# EAGLE design EcobitNRF9160 EV3 (EAGLE 9.3.0)
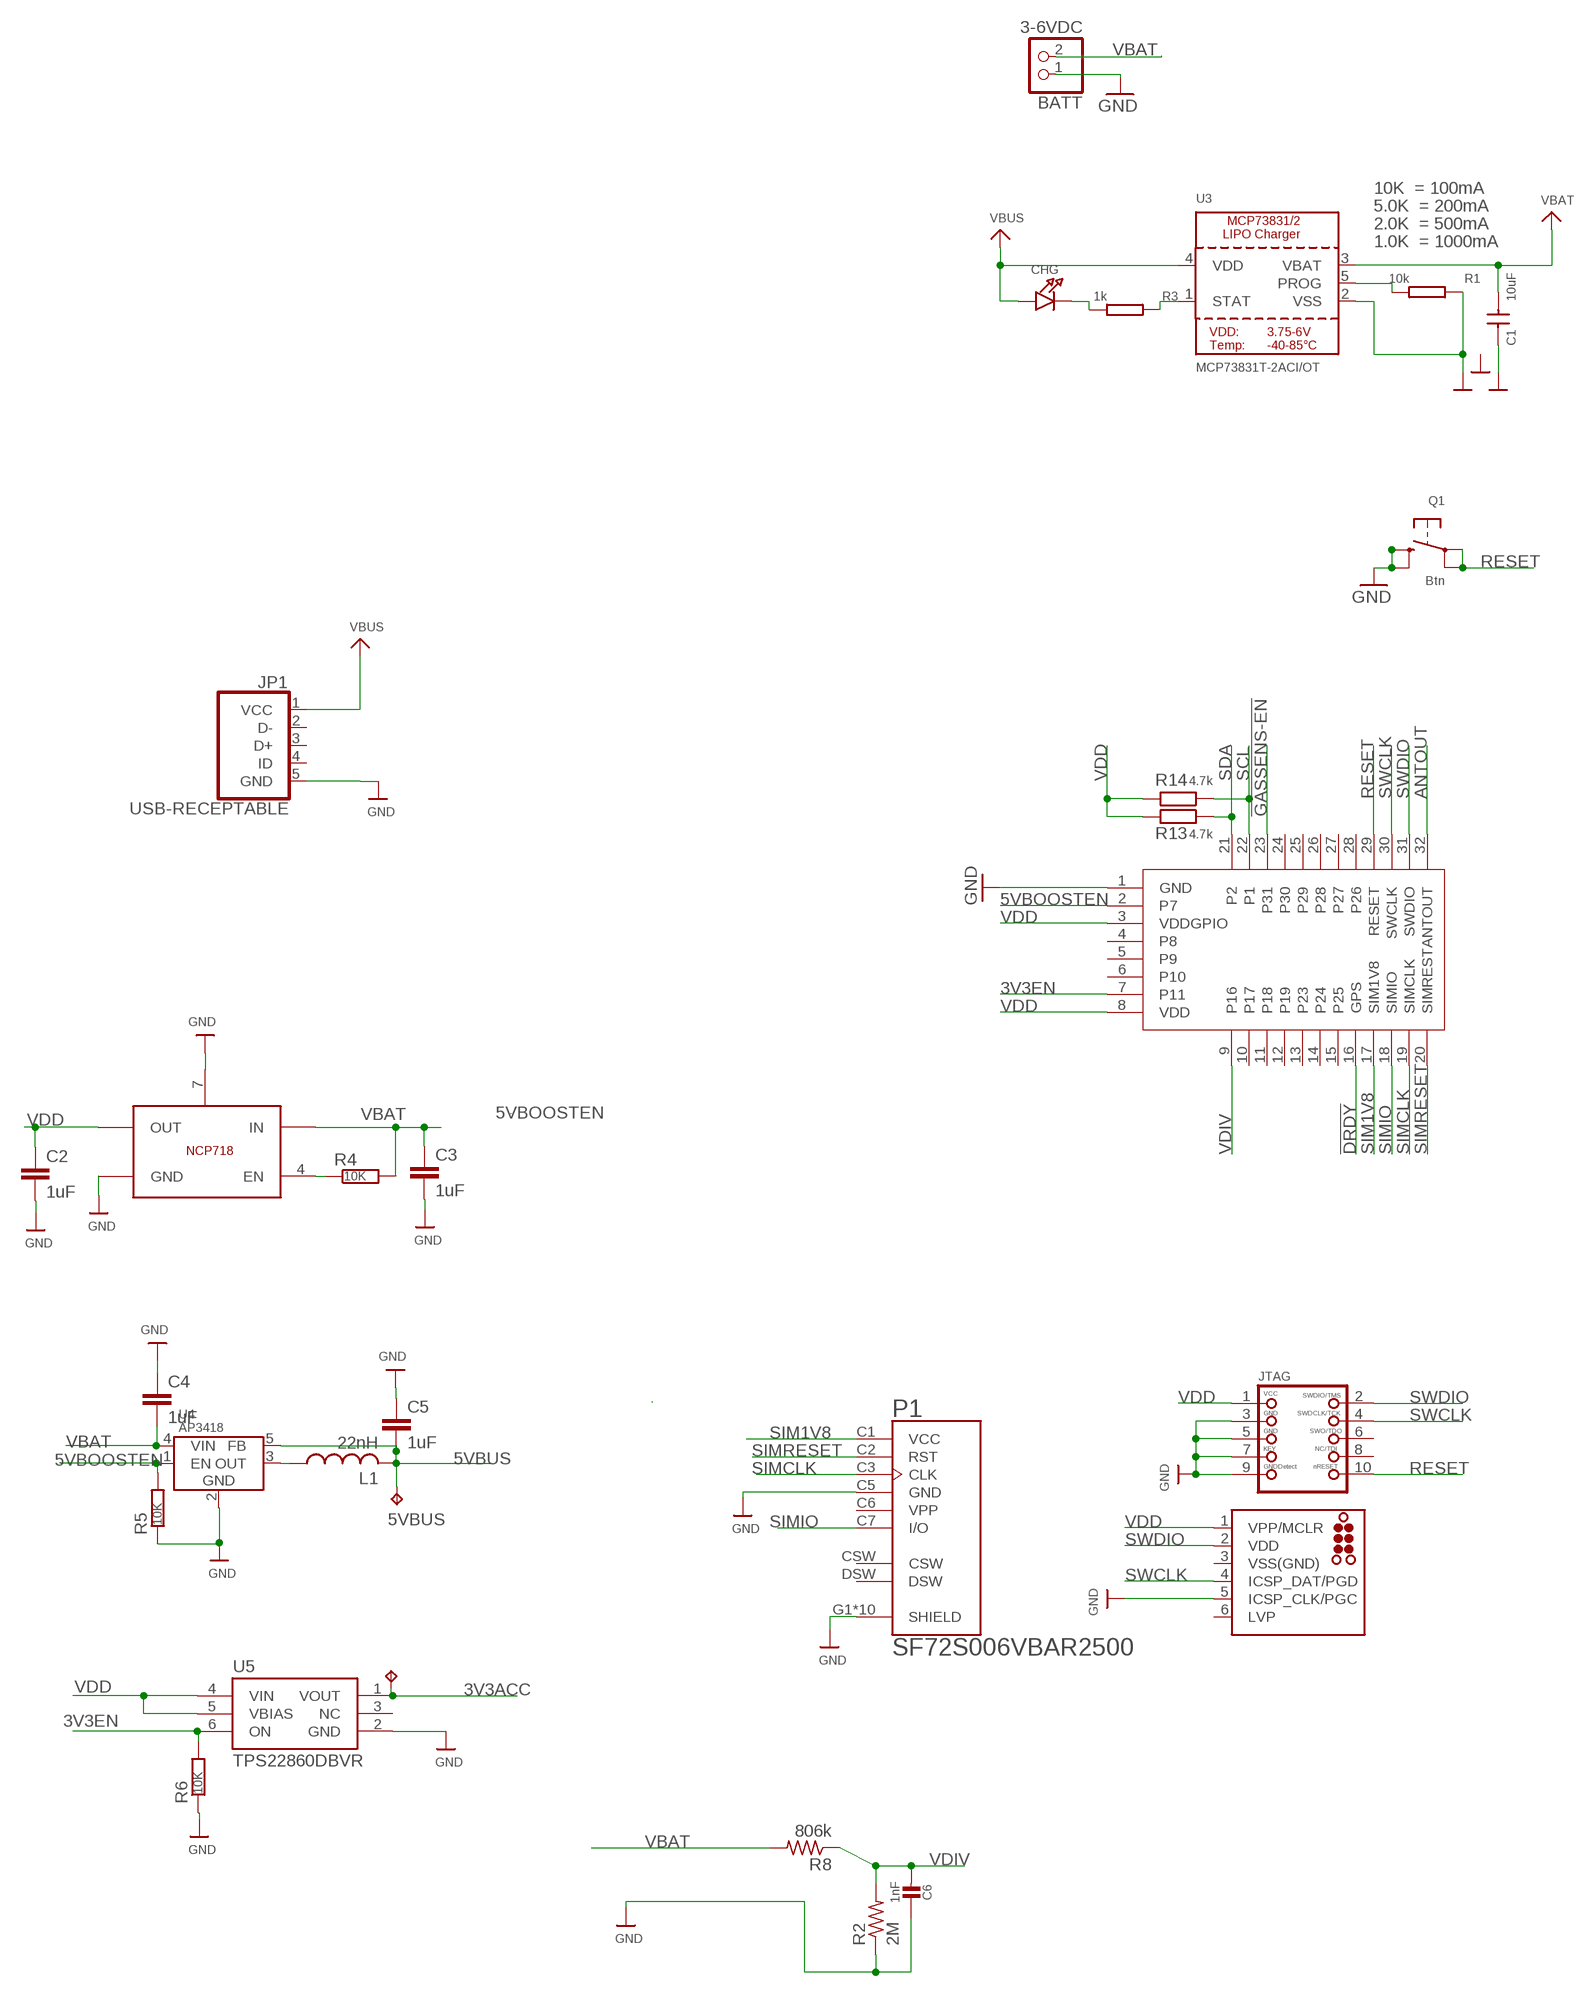
[diagram p0: schematic, sheet 1, part 1 of 2]
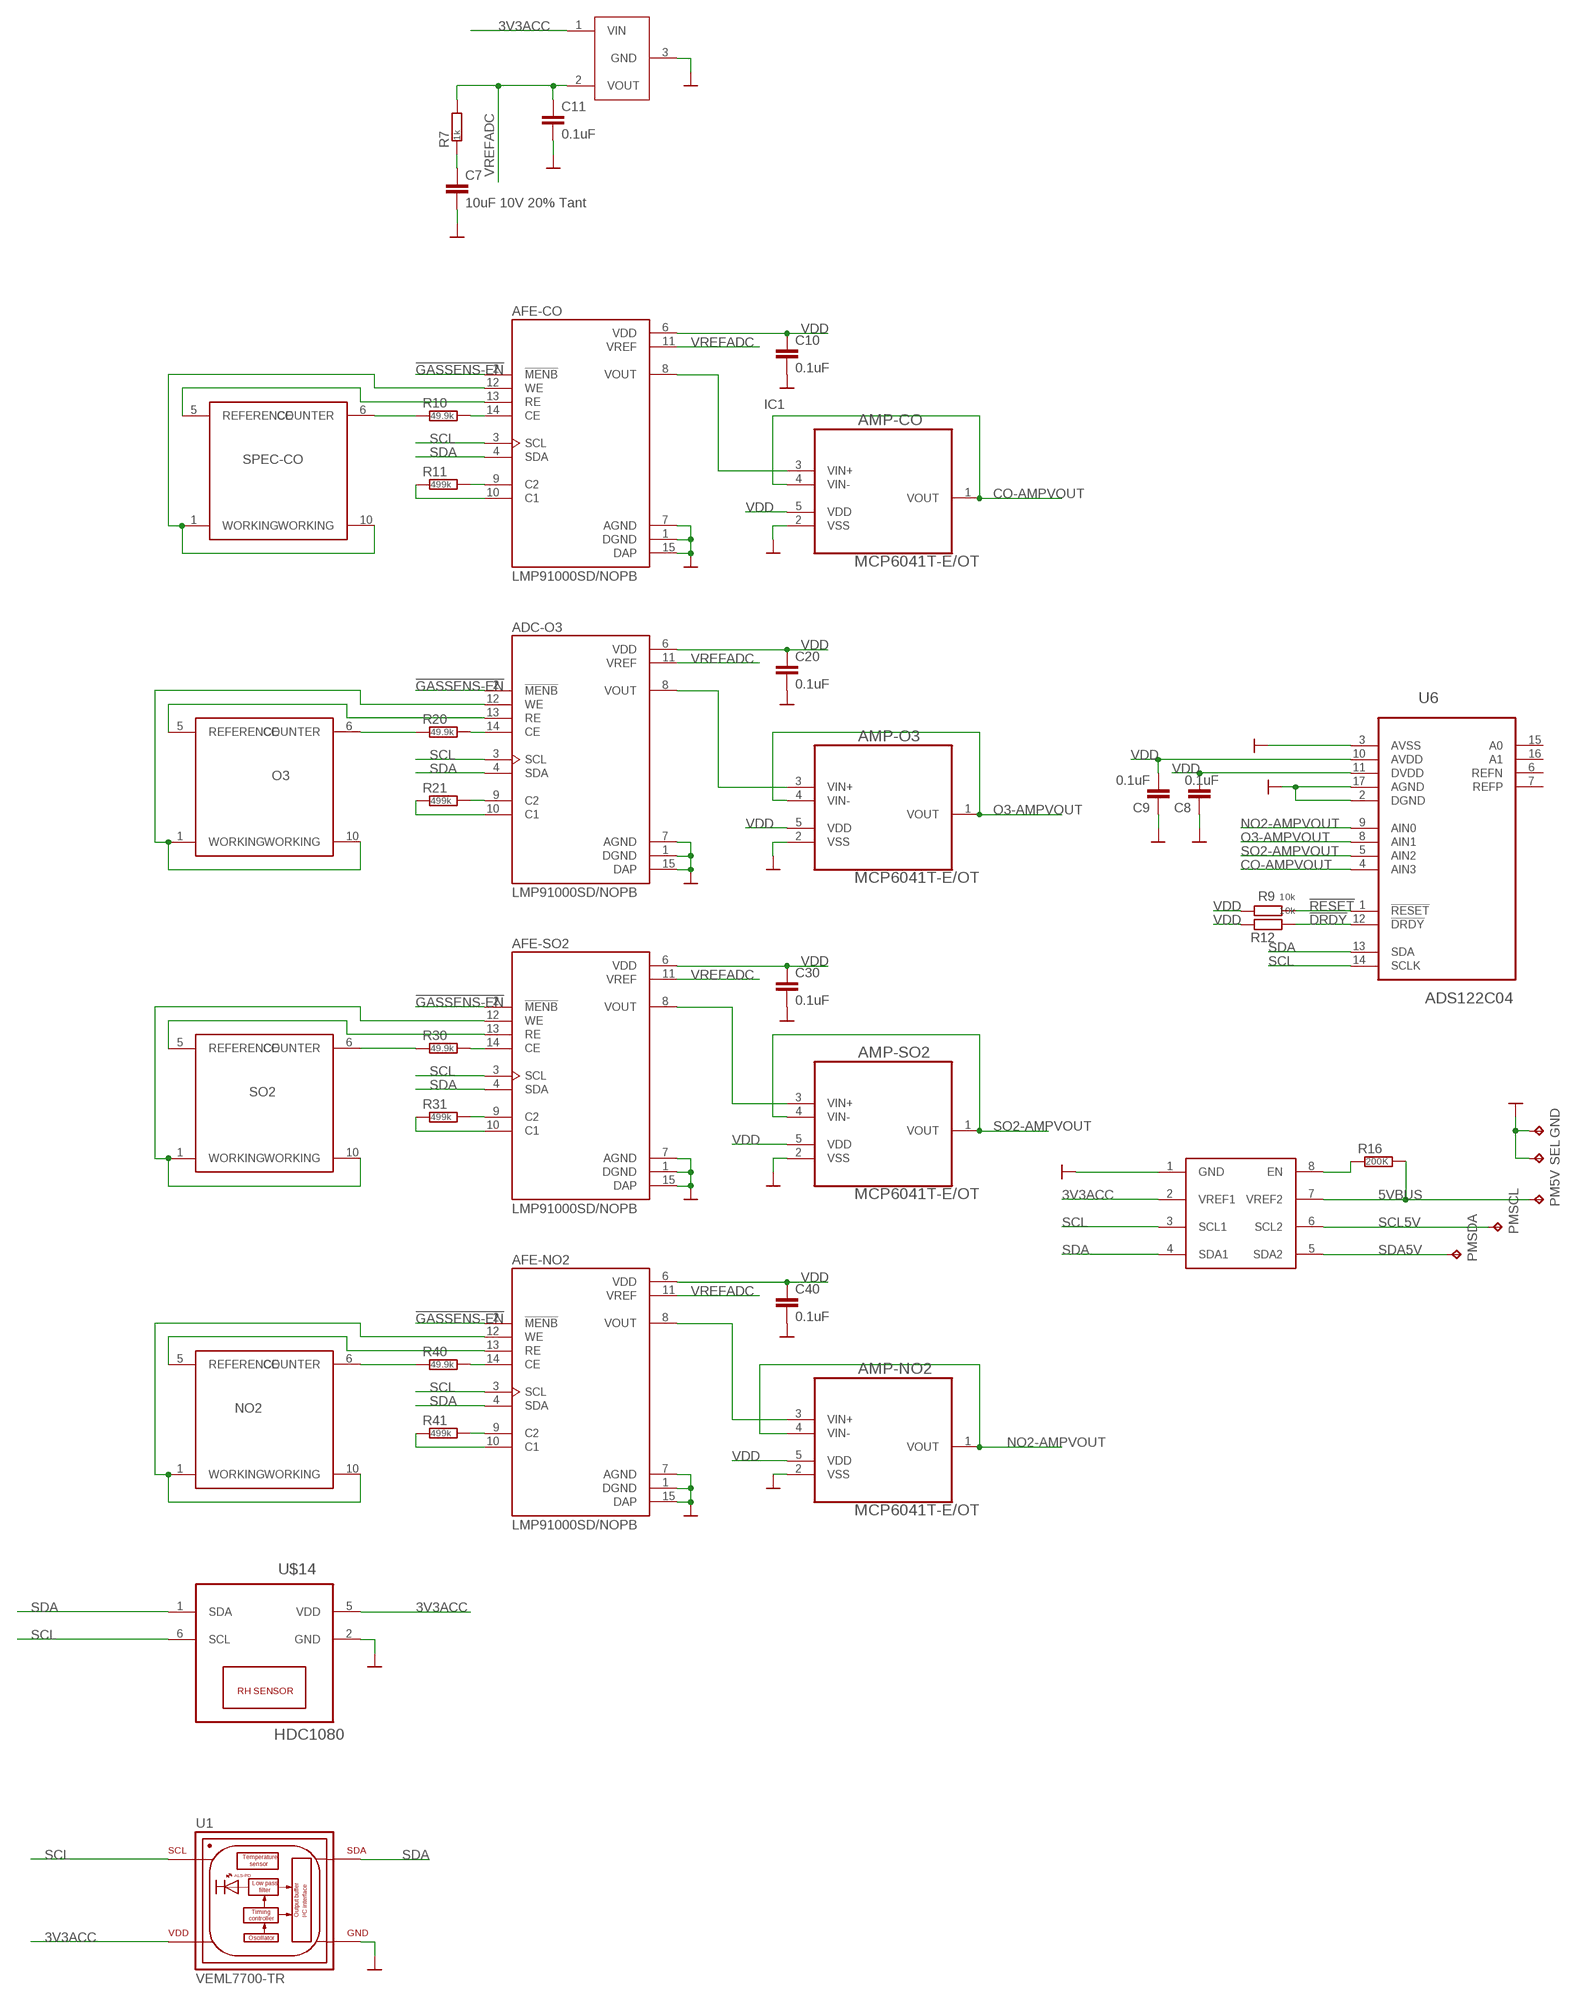
[diagram p1: schematic, sheet 1, part 2 of 2]

## Parts
5VBUS  TPTP15R  [TP15R]
5VBUS1  TPTP15R  [TP15R]
ADC-O3  LMP91000SD/NOPB  [SON50P400X400X80-15N]
AFE-CO  LMP91000SD/NOPB  [SON50P400X400X80-15N]
AFE-NO2  LMP91000SD/NOPB  [SON50P400X400X80-15N]
AFE-SO2  LMP91000SD/NOPB  [SON50P400X400X80-15N]
AMP-CO  MCP6041T-E/OT  [SOT95P320X145-5N]
AMP-NO2  MCP6041T-E/OT  [SOT95P320X145-5N]
AMP-O3  MCP6041T-E/OT  [SOT95P320X145-5N]
AMP-SO2  MCP6041T-E/OT  [SOT95P320X145-5N]
BATT  3-6VDC  CON_JST_PH_2PIN  [JSTPH2]
C1  10uF  CAP0402  [C-0402]
C2  1uF  CAPACITOR_0402_N  [RESC0402_N]
C3  1uF  CAPACITOR_0402_N  [RESC0402_N]
C4  1uF  CAPACITOR_0402_N  [RESC0402_N]
C5  1uF  CAPACITOR_0402_N  [RESC0402_N]
C6  1nF  CAP_CERAMIC0603_NO  [0603-NO]
C7  10uF 10V 20% Tant  CAPACITOR_0805_N  [RESC0805_N]
C8  0.1uF  CAPACITOR_0603_N  [RESC0603_N]
C9  0.1uF  CAPACITOR_0603_N  [RESC0603_N]
C10  0.1uF  CAPACITOR_0603_N  [RESC0603_N]
C11  0.1uF  CAPACITOR_0603_N  [RESC0603_N]
C20  0.1uF  CAPACITOR_0603_N  [RESC0603_N]
C30  0.1uF  CAPACITOR_0603_N  [RESC0603_N]
C40  0.1uF  CAPACITOR_0603_N  [RESC0603_N]
CHG  LED0805_NOOUTLINE  [CHIPLED_0805_NOOUTLINE]
GND  TPTP15R  [TP15R]
IC1  ISL60002DIH320Z-TK  [SOT-23-3]
J2  TC2030-MCP-NL  [TC2030-MCP-NL]
JP1  USB-RECEPTABLE  [FCI-10103594-0001LF]
JTAG  JTAG-CORTEXM3  [2X05_1.27MM_SMT]
L1  22nH  INDUCTOR_0603_N  [RESC0603_N]
P1  SF72S006VBAR2500  [JAE_SF72S006VBAR2500]
PM5V  TPTP15R  [TP15R]
PMSCL  TPTP15R  [TP15R]
PMSDA  TPTP15R  [TP15R]
Q1  Btn  SWITCH_TACT_SMT4.6X2.8  [BTN_KMR2_4.6X2.8]
R1  10k  RESR0402  [R0402]
R2  2M  R-US_R0603  [R0603]
R3  1k  RESR0402  [R0402]
R4  10K  RESISTOR_0402_N  [RESC0402_N]
R5  10K  RESISTOR_0402_N  [RESC0402_N]
R6  10K  RESISTOR_0402_N  [RESC0402_N]
R7  1k  RESISTOR_0603_N  [RESC0603_N]
R8  806k  R-US_R0603  [R0603]
R9  10k  RESISTOR_0603_N  [RESC0603_N]
R10  49.9k  RESISTOR_0603_N  [RESC0603_N]
R11  499k  RESISTOR_0603_N  [RESC0603_N]
R12  10k  RESISTOR_0603_N  [RESC0603_N]
R13  4.7k  RESISTOR_0603_N  [RESC0603_N]
R14  4.7k  RESISTOR_0603_N  [RESC0603_N]
R16  200K  RESISTOR_0402_N  [RESC0402_N]
R20  49.9k  RESISTOR_0603_N  [RESC0603_N]
R21  499k  RESISTOR_0603_N  [RESC0603_N]
R30  49.9k  RESISTOR_0603_N  [RESC0603_N]
R31  499k  RESISTOR_0603_N  [RESC0603_N]
R40  49.9k  RESISTOR_0603_N  [RESC0603_N]
R41  499k  RESISTOR_0603_N  [RESC0603_N]
SEL  TPTP15R  [TP15R]
SENS-CO  SPECSENSOR  [SPECSENSOR]
SENS-NO2  SPECSENSOR  [SPECSENSOR]
SENS-O3  SPECSENSOR  [SPECSENSOR]
SENS-SO2  SPECSENSOR  [SPECSENSOR]
U1  VEML7700-TR  [XDCR_VEML7700-TR]
U2  NCP718  [NCP718-WDFN6]
U3  MCP73831T-2ACI/OT  MCP73831/2  [SOT23-5]
U4  AP3418  [SOT25]
U5  TPS22860DBVR  [R-PDSO-G6]
U6  ADS122C04  [QFN50P300X300X80-16N]
U7  PCA9306  [PSON35P135X100X50-8N]
U$14  HDC1080  [TI-S-PWSON-N6]
U$35  NRF9160MODULE  [NRF9160CASTALLATEDMODULE]

## Nets
3V3ACC: 5VBUS1.TP IC1.1(VIN) U1.2(VDD) U5.1(VOUT) U7.2(VREF1) U$14.5(VDD)
3V3EN: R6.2 U5.6(ON) U$35.7(P11)
5VBOOSTEN: R5.2 U4.1(EN) U$35.2(P7)
5VBUS: 5VBUS.TP C5.2 L1.2 PM5V.TP R16.2 U4.5(FB) U7.7(VREF2)
!DRDY: R12.1 U6.12(!DRDY) U$35.16(GPS)
!GASSENS-EN: ADC-O3.2(!MENB) AFE-CO.2(!MENB) AFE-NO2.2(!MENB) AFE-SO2.2(!MENB) U$35.23(P31)
!RESET: R9.1 U6.1(!RESET)
ANTOUT: U$35.32(ANTOUT)
CO-AMPVOUT: AMP-CO.1(VOUT) AMP-CO.4(VIN-) U6.4(AIN3)
COVOUT: AFE-CO.8(VOUT) AMP-CO.3(VIN+)
GND: ADC-O3.1(DGND) ADC-O3.7(AGND) ADC-O3.15(DAP) AFE-CO.1(DGND) AFE-CO.7(AGND) AFE-CO.15(DAP) AFE-NO2.1(DGND) AFE-NO2.7(AGND) AFE-NO2.15(DAP) AFE-SO2.1(DGND) AFE-SO2.7(AGND) AFE-SO2.15(DAP) AMP-CO.2(VSS) AMP-NO2.2(VSS) AMP-O3.2(VSS) AMP-SO2.2(VSS) BATT.1 C1.2 C2.2 C3.2 C4.1 C5.1 C6.1 C7.2 C8.1 C9.1 C10.2 C11.2 C20.2 C30.2 C40.2 GND.TP IC1.3(GND) J2.5(ICSP_CLK/PGC) JP1.5(GND) JTAG.3 JTAG.5 JTAG.7 JTAG.9 P1.C5(GND) P1.G1(SHIELD) P1.G2(SHIELD) P1.G3(SHIELD) P1.G4(SHIELD) P1.G5(SHIELD) P1.G6(SHIELD) P1.G7(SHIELD) P1.G8(SHIELD) P1.G9(SHIELD) P1.G10(SHIELD) Q1.B'(S1) Q1.B(S) R1.1 R2.1 R5.1 R6.1 SEL.TP U1.3(GND) U2.3(GND) U2.7(GND) U3.2(VSS) U4.2(GND) U5.2(GND) U6.2(DGND) U6.3(AVSS) U6.17(AGND) U7.1(GND) U$14.2(GND) U$35.1(GND)
N$1: R16.1 U7.8(EN)
N$2: L1.1 U4.3(OUT)
N$3: R3.1 U3.1(STAT)
N$4: CHG.C R3.2
N$8: AFE-CO.9(C2) R11.2
N$9: AFE-CO.10(C1) R11.1
N$10: R1.2 U3.5(PROG)
N$11: AFE-CO.14(CE) R10.2
N$12: C7.1 R7.1
N$13: ADC-O3.9(C2) R21.2
N$14: ADC-O3.10(C1) R21.1
N$15: ADC-O3.14(CE) R20.2
N$16: AFE-SO2.9(C2) R31.2
N$17: AFE-SO2.10(C1) R31.1
N$18: AFE-SO2.14(CE) R30.2
N$19: AFE-NO2.9(C2) R41.2
N$20: AFE-NO2.10(C1) R41.1
N$21: AFE-NO2.14(CE) R40.2
NO2-AMPVOUT: AMP-NO2.1(VOUT) AMP-NO2.4(VIN-) U6.9(AIN0)
NO2VOUT: AFE-NO2.8(VOUT) AMP-NO2.3(VIN+)
O3-AMPVOUT: AMP-O3.1(VOUT) AMP-O3.4(VIN-) U6.8(AIN1)
O3VOUT: ADC-O3.8(VOUT) AMP-O3.3(VIN+)
R-EN: R4.1 U2.4(EN)
RESET: JTAG.10 Q1.A'(P1) Q1.A(P) U$35.29(RESET)
SCL: ADC-O3.3(SCL) AFE-CO.3(SCL) AFE-NO2.3(SCL) AFE-SO2.3(SCL) R14.1 U1.1(SCL) U6.14(SCLK) U7.3(SCL1) U$14.6(SCL) U$35.22(P1)
SCL5V: PMSCL.TP U7.6(SCL2)
SDA: ADC-O3.4(SDA) AFE-CO.4(SDA) AFE-NO2.4(SDA) AFE-SO2.4(SDA) R13.1 U1.4(SDA) U6.13(SDA) U7.4(SDA1) U$14.1(SDA) U$35.21(P2)
SDA5V: PMSDA.TP U7.5(SDA2)
SIM1V8: P1.C1(VCC) U$35.17(SIM1V8)
SIMCLK: P1.C3(CLK) U$35.19(SIMCLK)
SIMIO: P1.C7(I/O) U$35.18(SIMIO)
SIMRESET: P1.C2(RST) U$35.20(SIMREST)
SO2-AMPVOUT: AMP-SO2.1(VOUT) AMP-SO2.4(VIN-) U6.5(AIN2)
SO2VOUT: AFE-SO2.8(VOUT) AMP-SO2.3(VIN+)
SPEC-CO-COUNTER: R10.1 SENS-CO.6(COUNTER)
SPEC-CO-REF: AFE-CO.13(RE) SENS-CO.5(REFERENCE)
SPEC-CO-WKG: AFE-CO.12(WE) SENS-CO.1(WORKING) SENS-CO.10(WORKING)
SPEC-NO2-COUNTER: R40.1 SENS-NO2.6(COUNTER)
SPEC-NO2-REF: AFE-NO2.13(RE) SENS-NO2.5(REFERENCE)
SPEC-NO2-WKG: AFE-NO2.12(WE) SENS-NO2.1(WORKING) SENS-NO2.10(WORKING)
SPEC-O3-COUNTER: R20.1 SENS-O3.6(COUNTER)
SPEC-O3-REF: ADC-O3.13(RE) SENS-O3.5(REFERENCE)
SPEC-O3-WKG: ADC-O3.12(WE) SENS-O3.1(WORKING) SENS-O3.10(WORKING)
SPEC-SO2-COUNTER: R30.1 SENS-SO2.6(COUNTER)
SPEC-SO2-REF: AFE-SO2.13(RE) SENS-SO2.5(REFERENCE)
SPEC-SO2-WKG: AFE-SO2.12(WE) SENS-SO2.1(WORKING) SENS-SO2.10(WORKING)
SWCLK: J2.4(ICSP_DAT/PGD) JTAG.4 U$35.30(SWCLK)
SWDIO: J2.2(VDD) JTAG.2 U$35.31(SWDIO)
VBAT: BATT.2 C1.1 C3.1 C4.2 R4.2 R8.2 U2.6(IN) U3.3(VBAT) U4.4(VIN)
VBUS: CHG.A JP1.1(VCC) U3.4(VDD)
VDD: ADC-O3.6(VDD) AFE-CO.6(VDD) AFE-NO2.6(VDD) AFE-SO2.6(VDD) AMP-CO.5(VDD) AMP-NO2.5(VDD) AMP-O3.5(VDD) AMP-SO2.5(VDD) C2.1 C8.2 C9.2 C10.1 C20.1 C30.1 C40.1 J2.1(VPP/MCLR) JTAG.1 R9.2 R12.2 R13.2 R14.2 U2.1(OUT) U5.4(VIN) U5.5(VBIAS) U6.10(AVDD) U6.11(DVDD) U$35.3(VDDGPIO) U$35.8(VDD)
VDIV: C6.2 R2.2 R8.1 U$35.9(P16)
VREFADC: ADC-O3.11(VREF) AFE-CO.11(VREF) AFE-NO2.11(VREF) AFE-SO2.11(VREF) C11.1 IC1.2(VOUT) R7.2
Unconnected: J2.6(LVP) JP1.2(D-) JP1.3(D+) JP1.4(ID) JTAG.6 JTAG.8 P1.CSW P1.DSW U5.3(NC) U6.6(REFN) U6.7(REFP) U6.15(A0) U6.16(A1) U$35.4(P8) U$35.5(P9) U$35.6(P10) U$35.10(P17) U$35.11(P18) U$35.12(P19) U$35.13(P23) U$35.14(P24) U$35.15(P25) U$35.24(P30) U$35.25(P29) U$35.26(P28) U$35.27 U$35.28(P26)

## Notes on the sheet
- 10K  = 100mA
- 5.0K  = 200mA
- 2.0K  = 500mA
- 1.0K  = 1000mA

## Power pins joined to a net without a drawn wire
VPP: P1.C6(VPP)
VSS(GND): J2.3(VSS(GND))

## Library data of the parts
5VBUS 5VBUS1 GND PM5V PMSCL PMSDA SEL = testpad:TP: Test pad
ADC-O3 AFE-CO AFE-NO2 AFE-SO2 = LMP91000SD_NOPB:LMP91000SD/NOPB: Configurable AFE Potentiostat for Low-Power Chemical Sensing Applications 14-WSON -40 to 85; AVAILABILITY: Unavailable; DESCRIPTION: Configurable AFE Potentiostat for Low-Power Chemical Sensing Applications 14-WSON -40 to 85; MF: Texas Instruments; MP: LMP91000SD/NOPB; PACKAGE: WFDFN-14 Texas Instruments; PRICE: None
AMP-CO AMP-NO2 AMP-O3 AMP-SO2 = MCP6041T:MCP6041T-E/OT: IC, OP-AMP, 14kHZ, 0.003V/µs, 3mV; AVAILABILITY: Unavailable; DESCRIPTION: MCP6041 Series 6 V 14 kHz 600 nA Rail-to-Rail I/O Operational Amplifier SOT-23-5; MF: Microchip; MP: MCP6041T-E/OT; PACKAGE: SOT-23-5 Microchip; PRICE: None
BATT = microbuilder:CON_JST_PH_2PIN: JST 2-Pin Right-Angle Connector PH-Series - 4UConnector: 17311 SH-Series - 4UConnector: 07278
C1 = NANO2:CAP: CAP
C2-C5 C7-C11 C20 C30 C40 = NordicMisc:CAPACITOR: Generic chip capacitor
C6 = microbuilder:CAP_CERAMIC: Ceramic Capacitors For new designs, use the packages preceded by an '_' character since they are more reliable: The following footprints should be used on most boards: _0402 - Standard footprint for regular board layouts _0603 - Standard footprint for regular board layouts _0805 - Standard footprint for regular board layouts _1206 - Standard footprint for regular board layouts For extremely tight-pitch boards where space is at a premium, the following 'micro-pitch' footprints can be used (smaller pads, no silkscreen outline, etc.): _0402MP - Micro-pitch footprint for very dense/compact boards _0603MP - Micro-pitch footprint for very dense/compact boards _0805MP - Micro-pitch footprint for very dense/compact boards _1206MP - Micro-pitch footprint for very dense/compact boards
CHG = microbuilder:LED: LED 0603 - 0603 Surface Mount Package 2mA: Green LED - Low Power (3.9mcd, 2ma, 1.7Vf) - Digikey: 475-2709-2-ND Orange LED - Low Power (9.8mcd, 2ma, 1.8Vf) - Digikey: 475-1194-2-ND Red LED - Low Power (5mcd, 2ma, 1.8Vf) - Digikey: 475-1195-2-ND Yellow LED - Low Power (7mcd, 2ma, 1.8Vf) - Digikey: 475-1196-2-ND 5mA: Blue LED - Low Power (17mcd, 5ma, 2.9Vf) - Digikey: LNJ937W8CRACT-ND 0805 - 0805 Surface Mount Package 2mA: Red LED (8.8mcd, 2mA, 1.8Vf, Clear) - Low Power [Digikey: 475-2510-1-ND] Green LED (5mcd, 2mA, 1.8Vf, Clear) - Low Power [Digikey: 475-2730-1-ND] Yellow LED (11.3mcd, 2mA, 1.8Vf, Clear) - Low Power [Digikey: 475-2555-1-ND] 20mA: Red LED (104mcd, 20mA, Diffused) - LS R976 [Digikey: 475-1278-6-ND] Red LED (12mcd, 20mA, 2.0Vf, Clear) - APT2012EC [Digikey: 754-1128-1-ND] Green LED (15mcd, 20mA, 2.2Vf, Clear) - APT2012GC [Digikey: 754-1131-1-ND] Orange LED (160mcd, 20mA, 2.1Vf, Clear) - APT2012SECK [Digikey: 754-1130-1-ND] 1206 - 1206 Surface Mount Package Green LED (26mcd, 20mA, Diffused) - LG N971 [Digikey: 475-1407-6-ND] Red LED (15mcd, 20mA, Diffused) - LH N974 [Digikey: 475-1416-6-ND] Cree - Cree High-Power Surface Mount LEDs XPEBWT-L1-0000-00D50 - White 111lm 350mA 2.9Vf 6200K 110° XTEAWT-00-0000-00000LEE3 - White 114lm 350mA 2.85Vf 5000K 115° Everlight - Everlight 45-21 Series Surface Mount LEDs 45-21/QK2C-B2832AC2CB2/2T - Warm White 2000mcd 20mA 3.25Vf 3050K 120° 45-21/LK2C-B38452C4CB2/2T - Nuetral White 2000mcd 20mA 3.25Vf 4150K 120° 45-21/LK2C-B50634C6CB2/2T - Cold White 2200mcd 20mA 3.25Vf 5650K 120° PLCC2 Reverse Mount LS T77K-J1L2-1-0-2-R18-Z - Red 11.25mcd 2mA 1.8Vf 630nm 120° LO T77K-L1M2-24-Z - Orange 19.6mcd 2mA 1.8Vf 606nm 120° LY T77K-K2M1-26-Z - Yellow 15.7mcd 2mA 1.8Vf 587nm 120°
IC1 = ISL60002DIH320Z-TK:ISL60002DIH320Z-TK
J2 = tag-connect:TC2030: TAG-CONNECT ICSP Connector Manufacturer: Tag-Connect <http://www.tag-connect.com> Cable for easy In-Circuit Serial Programming. Designed for Microchip ICD2, suitable for many others. Two variants - one "with legs" (for hands-free fit on PCB) and another "without legs" for quick programming. PAD Description 1 MCLR/Vpp 2 Vdd 3 GND 4 PGD (ISPDAT) 5 PGC (ISPCLK) 6 nc (used for LVP) ©2009 ROFA.cz - modified and updated by Robert Darlington ‹rdarlington@gmail.com›
JP1 = daspilker MICROUSB:USB-RECEPTABLE: USB Receptable
JTAG = SiliconSquared:JTAG-CORTEXM3: Serial Wire (SW-DP) Connector This standard 0.05" 10-pin connector is for use with the Cortex M0/M3's native SWD (serial wire debugger) interface (SW-DP). Some boards support a 20-pin combined JTAG+SWD connector (SWJ-DP), such as the LPC1700 family, but many smaller devices only work with SWD which typically use the smaller 10-pin SW-DP connecter (the LPC1300 family, for example, only supports SWD). 2x05 1.27mm/0.05" Connector: This is the standard SMT connector defined by ARM for all Cortex devices, and should be used in most situations and for forward-compatibility since any new devices coming to market will likely use this connector. MOLEX 10 Pin 0.1" Connector: This 0.1" 10 pin connector has the same pin layout as the standard 0.05" connector, but is easier to work with if you are using standard jumper wires or custom cables to connect your SWD hardware. MOLEX 20 Pin 0.1" Connector: This 0.1" 20 pin connector is the same model used for ARM7/ARM9 JTAG debuggers, but is connected to match the pins on the Segger J-Link for ARM (which supports both JTAG and SWD debugging). See the following document from ARM for more information on Cortex M3 Debug Connectors: http://infocenter.arm.com/help/topic/com.arm.doc.faqs/attached/13634/cortex_debug_connectors.pdf And the following page for an overview with images of the different connector types: http://www.keil.com/peripherals/coresight/connectors.asp
L1 = NordicMisc:INDUCTOR: Generic chip inductor
P1 = SF72S006VBAR2500:SF72S006VBAR2500: SF72 series, nano-SIM card connector, normail open type, 6 connector; AVAILABILITY: Unavailable; DESCRIPTION: SF72 series, nano-SIM card connector, normail open type, 6 connector; MF: JAE Electronics; MP: SF72S006VBAR2500; PACKAGE: None; PRICE: None
Q1 = microbuilder:SWITCH_TACT_SMT: SMT Tact Switches 6x6mm - Digikey: P12940SCT-ND KMR2 (4.6x2.8mm) - Digikey: 401-1426-1-ND EVQ-PQHB55 - Light Touch, 160GF (4.5x4.5mm) - Digikey: P8090SCT-ND KMT0 - KMT021 NGJ LHS (etc.) IP68/Waterproof - Digikey: CKN10289CT-ND
R1 R3 = 1RedBeard:RES: RES
R2 R8 = resistor:R-US_: RESISTOR, American symbol
R4-R7 R9-R14 R16 R20 R21 R30 R31 R40 R41 = NordicMisc:RESISTOR: Generic chip resistor
SENS-CO SENS-NO2 SENS-O3 SENS-SO2 = SiliconSquared:SPECSENSOR
U1 = VEML7700-TR:VEML7700-TR: Light to Digital Ambient Light Sensor Digital 0lux to 167000lux 8-Pin SMD T/R; DESCRIPTION: Light to Digital Ambient Light Sensor Digital 0lux to 167000lux 8-Pin SMD T/R; DIGI-KEY_PART_NUMBER: VEML7700CT-ND; DIGI-KEY_PURCHASE_URL: https://www.digikey.com/product-detail/en/vishay-semiconductor-opto-division/VEML7700-TR/VEML7700CT-ND/5820244?utm_source=snapeda&utm_medium=aggregator&utm_campaign=symbol; MF: Vishay; MP: VEML7700-TR; PACKAGE: SMD-4 Vishay
U2 = NCP718 Low Dropout Regulator:NCP718
U3 = microbuilder:MCP73831/2: MCP73831/2 LIPO Charger VDD: 3.75 - 6V Temp -40 - 85°C Programmable Charge Rate: 15-500mA NOTE: STAT is a tri-state logic output on the MCP73831 and an open-drain output on the MCP73832. SOT23-5 with 4.2V output and tri-state logic on STAT = MCP73831T-2ACI/OT
U4 = AP3418 3v3 to 5V DCDC Booster:AP3418
U5 = TexasCustom:TPS22860DBVR: Power Switch ICs - Power Distribution TPS22860 Ultra-low leakage load switch 6-SOT-23 -40 to 85
U6 = TI ADS122C04 24bit ADC:ADS122C04: ANALOG-TO-DIGITAL CONVERTER; AVAILABILITY: Unavailable; DESCRIPTION: 12-bit, 4-ch MUX input SAR ADC with Intelligent System Power Control 16-WQFN -40 to 85; MF: Texas Instruments; MP: ADS7924IRTER; PACKAGE: WQFN-16 Texas Instruments; PRICE: None
U7 = PCA9306:PCA9306
U$14 = Texas HDC1080 Humidity-Temp sensor:HDC1080
U$35 = SiliconSquared:NRF9160MODULE

## Board
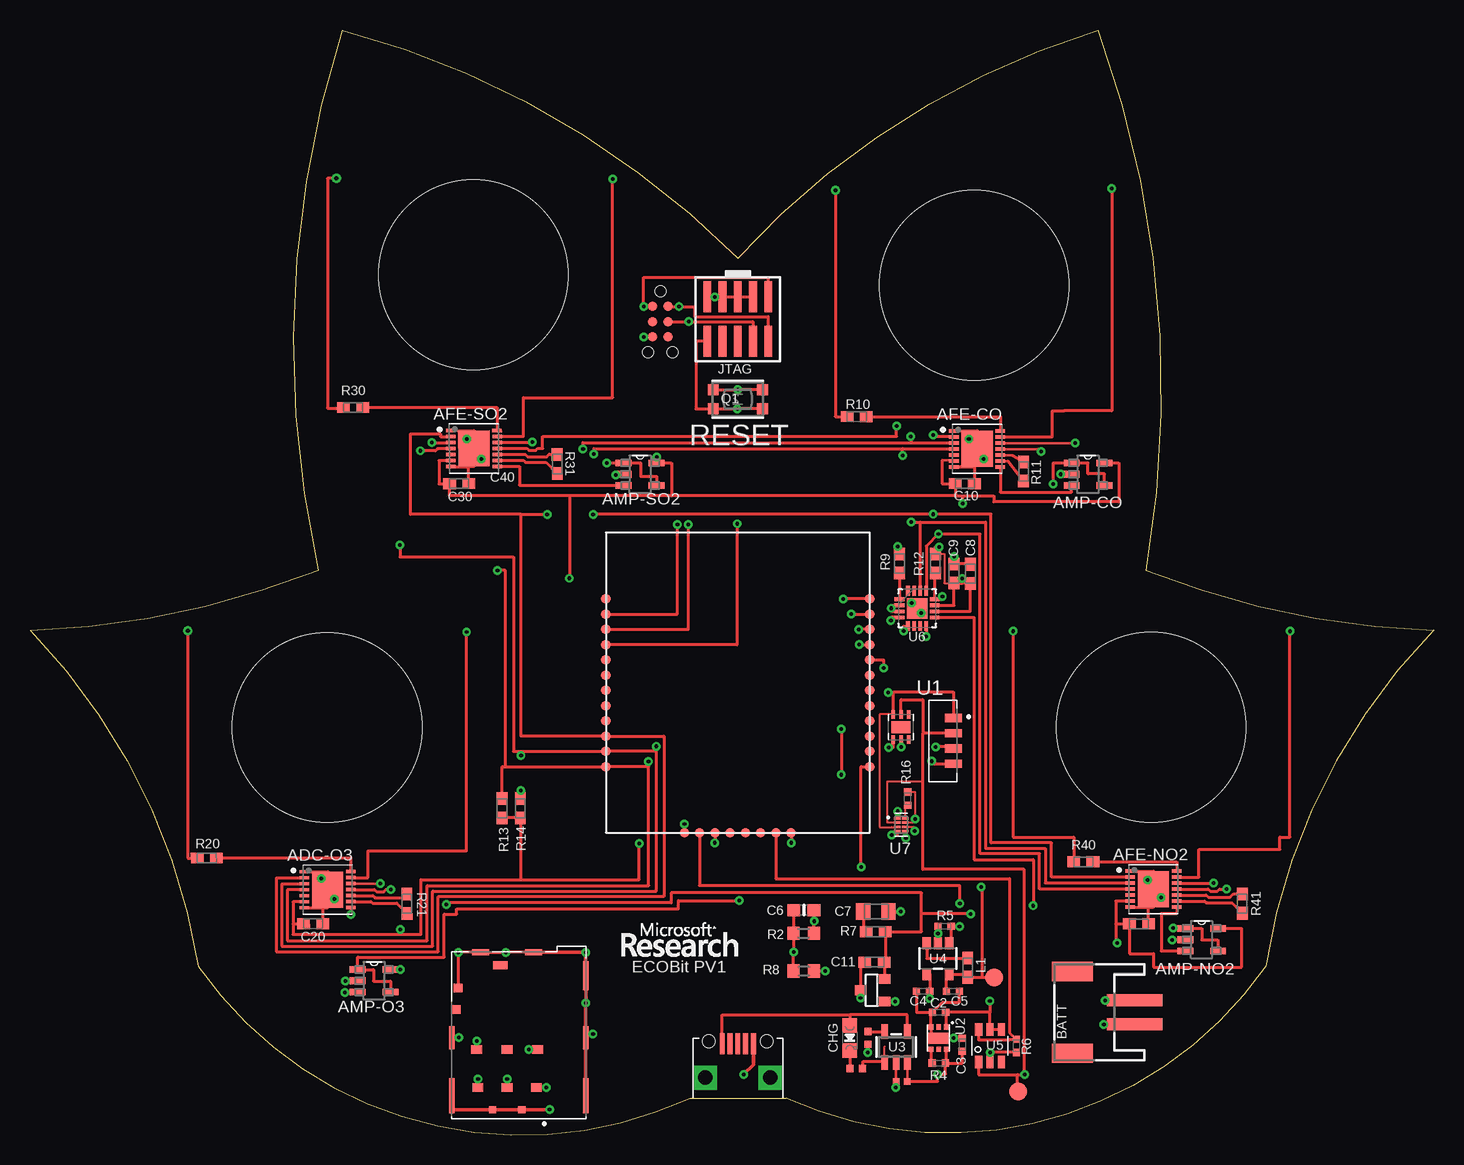
[diagram p2: board, top side]
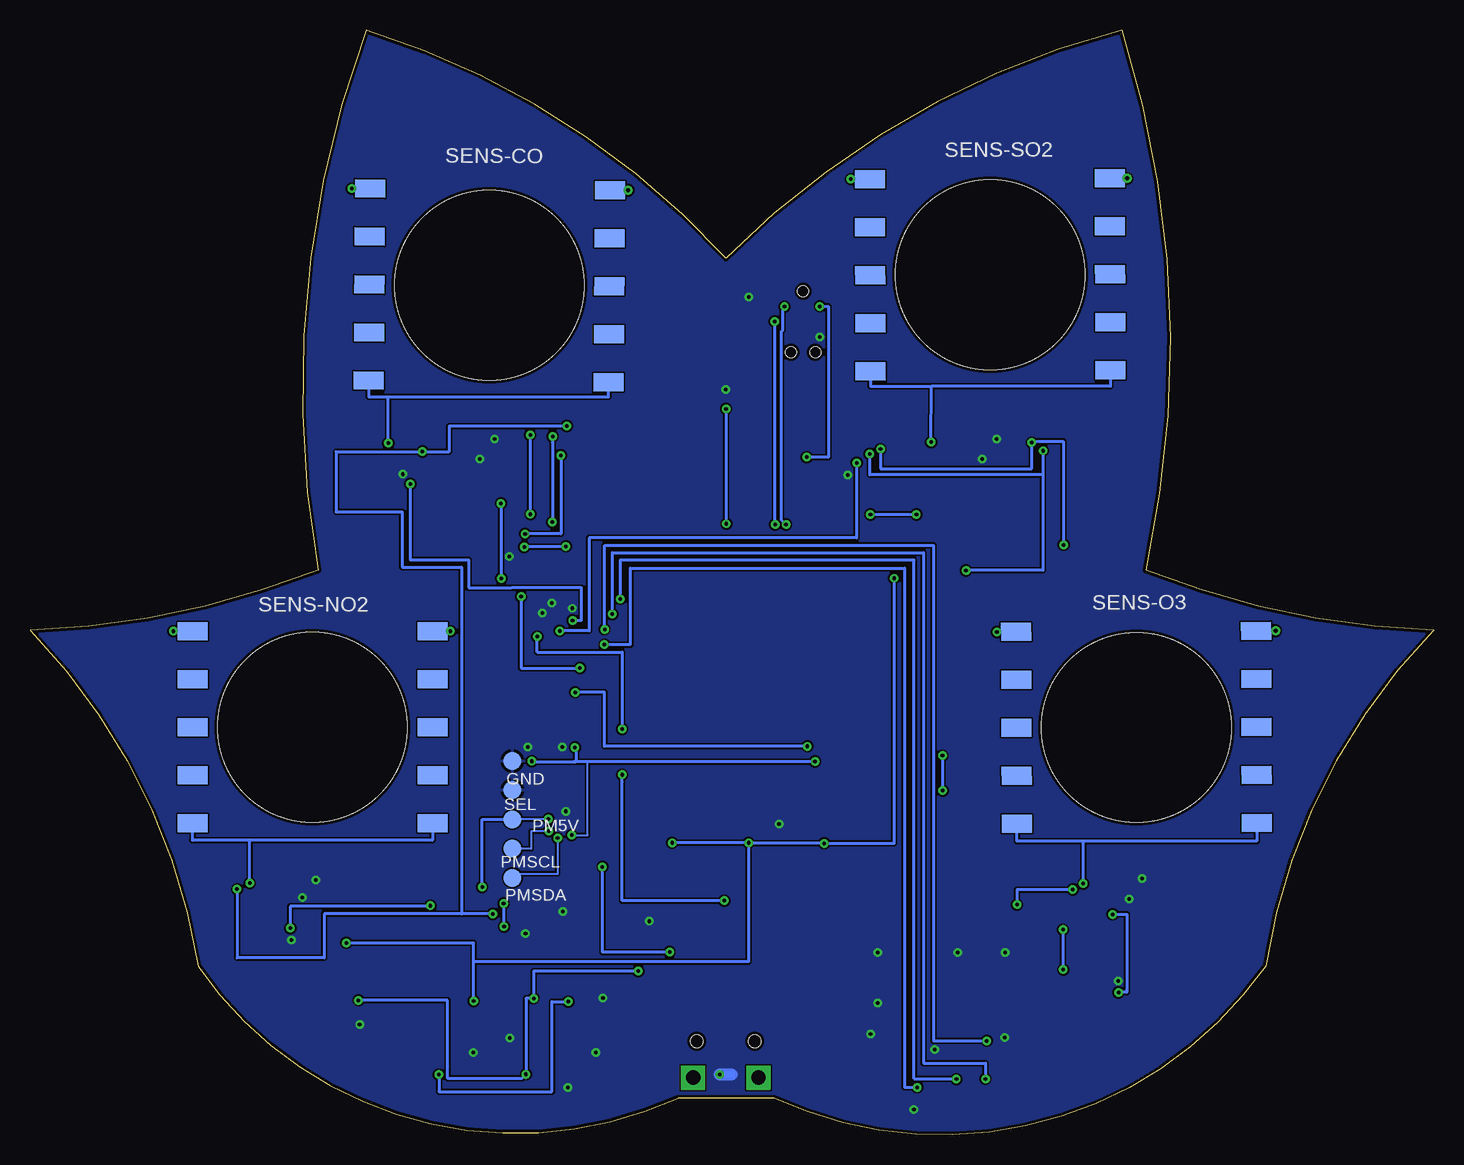
[diagram p3: board, bottom side, seen from below]

Size 117 x 92.07 mm. Coordinates in mm from the lower left corner, seen from the top.
Outline: 0,42.07 arc-35 14,14.07 arc80 55,3.07 63,3.07 arc80 103,14.07 arc-35 117,42.07 arc-20 93,47.07 arc30 89,92.07 arc30 59,73.07 arc30 26,92.07 arc30 24,47.07 arc-20 0,42.07
Copper layers (1*16): Top 0.035mm / dielectric 1.5mm / Bottom 0.035mm
Design rules "default *": minimum track width 6mil, minimum drill 0.3mm, track to track 6mil, track to pad 6mil, pad to pad 6mil, via to via 6mil, smd to smd 0mil, copper to edge 10mil, drill to drill 6mil, minimum pad ring 10mil, minimum via ring 8mil, stop-mask expansion 4mil, vias tented up to drill 0mil, thermal gap 10mil

### Footprints (pad centres in the part's own frame; a part is rotated, then mirrored left to right if it is on the bottom)
TP15R = smd 1.5 x 1.5: TP 0,0
SON50P400X400X80-15N = smd 0.86 x 0.27: 1 -1.935,1.5; 2 -1.935,1; 3 -1.935,0.5; 4 -1.935,0; 5 -1.935,-0.5; 6 -1.935,-1; 7 -1.935,-1.5; 8 1.935,-1.5; 9 1.935,-1; 10 1.935,-0.5; 11 1.935,0; 12 1.935,0.5; 13 1.935,1; 14 1.935,1.5 | smd 2.6 x 3: 15 0,0
SOT95P320X145-5N = smd 1.321 x 0.559: 1 -1.372,0.94; 2 -1.372,0; 3 -1.372,-0.94; 4 1.372,-0.94; 5 1.372,0.94
JSTPH2 = smd 1 x 4.6: 1 -1,-3.7; 2 1,-3.7 | smd 1.6 x 3.4: NC1 -3.4,1.5; NC2 3.4,1.5
C-0402 = smd 0.55 x 0.55: 1 -0.47,0; 2 0.47,0
RESC0402_N = smd 0.6 x 0.6: 1 -0.55,0; 2 0.55,0
0603-NO = smd 1.075 x 1: 1 -0.85,0; 2 0.85,0
RESC0805_N = smd 1.2 x 1.35: 1 -1.1,0; 2 1,0
RESC0603_N = smd 1.05 x 0.9: 1 -0.8,0; 2 0.8,0
CHIPLED_0805_NOOUTLINE = smd 1.2 x 1.2: A 0,-1.05; C 0,1.05
SOT-23-3 = smd 0.802 x 0.972: 1 -0.95,-1; 2 0.95,-1; 3 0,1
TC2030-MCP-NL = smd 0.787 x 0.787: 1 1.27,-0.635; 2 1.27,0.635; 3 2.54,-0.635; 4 2.54,0.635; 5 3.81,-0.635; 6 3.81,0.635 | hole 0.889: 0,0; 5.08,-1.016; 5.08,1.016
FCI-10103594-0001LF = smd 0.4 x 1.75: 1 -1.3,4.525; 2 -0.65,4.525; 3 0,4.525; 4 0.65,4.525; 5 1.3,4.525 | drill 1.2 pad 2 square: P$3 -2.725,1.7; P$4 2.725,1.7 | hole 1.05: -2.425,4.73; 2.425,4.73
2X05_1.27MM_SMT = smd 0.65 x 2.6: 1 -2.54,-1.85; 2 -2.54,1.85; 3 -1.27,-1.85; 4 -1.27,1.85; 5 0,-1.85; 6 0,1.85; 7 1.27,-1.85; 8 1.27,1.85; 9 2.54,-1.85; 10 2.54,1.85
JAE_SF72S006VBAR2500 = smd 0.9 x 0.7: C1 2.44,-4.575; C2 0,-4.575; C3 -2.44,-4.575; C5 2.54,-1.405; C6 0,-1.405; C7 -2.54,-1.405 | smd 0.7 x 0.7: CSW -4.245,1.925 | smd 1.2 x 0.65: DSW -0.55,5.6 | smd 0.45 x 2.9: G1 -4.595,-5.275; G8 6.555,-5.275 | smd 0.45 x 1.9: G2 -4.595,-0.425; G7 6.555,-0.425 | smd 0.75 x 0.7: G3 -4.095,3.725 | smd 1.4 x 0.5: G4 -2.2,6.675; G5 2.2,6.675 | smd 0.45 x 2.4: G6 6.555,4.725 | smd 0.6 x 0.6: G9 1.22,-6.425; G10 -1.22,-6.425
BTN_KMR2_4.6X2.8 = smd 0.9 x 0.9: A 2.05,0.8; A' -2.05,0.8; B 2.05,-0.8; B' -2.05,-0.8
R0402 = smd 0.6 x 0.6: 1 -0.525,0; 2 0.525,0
R0603 = smd 1 x 1.1: 1 -0.85,0; 2 0.85,0
SPECSENSOR = smd 2.5 x 1.5: 1 -10,-8; 2 -10,-4; 3 -10,0; 4 -10,4; 5 -10,8; 6 10,8; 7 10,4; 8 10,0; 9 10,-4; 10 10,-8 | hole 15.8: 0,0
XDCR_VEML7700-TR = smd 1.4 x 0.7: 1 0.55,1.905; 2 0.55,0.635; 3 0.55,-0.635; 4 0.55,-1.905
NCP718-WDFN6 = smd 0.4 x 0.45: 1 0.65,0.925; 2 0,0.925; 3 -0.65,0.925; 4 -0.65,-0.925; 5 0,-0.925; 6 0.65,-0.925 | smd 1.72 x 0.9: 7 0,0
SOT23-5 = smd 0.55 x 1.2: 1 -0.95,-1.3; 2 0,-1.3; 3 0.95,-1.3; 4 0.95,1.3; 5 -0.95,1.3
SOT25 = smd 1 x 0.7: 1 -1.3,0.95; 2 -1.3,0; 3 -1.3,-0.95; 4 1.3,-0.95; 5 1.3,0.95
R-PDSO-G6 = smd 0.6 x 1.05: 1 -0.95,-1.35; 2 0,-1.35; 3 0.95,-1.35; 4 0.95,1.35; 5 0,1.35; 6 -0.95,1.35
QFN50P300X300X80-16N = smd 0.813 x 0.305: 1 -1.473,0.762; 2 -1.473,0.254; 3 -1.473,-0.254; 4 -1.473,-0.762; 9 1.473,-0.762; 10 1.473,-0.254; 11 1.473,0.254; 12 1.473,0.762 | smd 0.305 x 0.813: 5 -0.762,-1.473; 6 -0.254,-1.473; 7 0.254,-1.473; 8 0.762,-1.473; 13 0.762,1.473; 14 0.254,1.473; 15 -0.254,1.473; 16 -0.762,1.473 | smd 1.702 x 1.702: 17 0,0
PSON35P135X100X50-8N = smd 0.53 x 0.2: 1 -0.335,0.525; 2 -0.335,0.175; 3 -0.335,-0.175; 4 -0.335,-0.525; 5 0.335,-0.525; 6 0.335,-0.175; 7 0.335,0.175; 8 0.335,0.525
TI-S-PWSON-N6 = smd 0.3 x 0.7: 1 -0.65,-1.05; 2 0,-1.05; 3 0.65,-1.05; 4 0.65,1.05; 5 0,1.05; 6 -0.65,1.05 | smd 1.6 x 1: 7 0,0
NRF9160CASTALLATEDMODULE = smd 0.8 x 0.8: 1 -12.5,4.445; 2 -12.5,3.175; 3 -12.5,1.905; 4 -12.5,0.635; 5 -12.5,-0.635; 6 -12.5,-1.905; 7 -12.5,-3.175; 8 -12.5,-4.445; 9 -6.985,-11; 10 -5.715,-11; 11 -4.445,-11; 12 -3.175,-11; 13 -1.905,-11; 14 -0.635,-11; 15 0.635,-11; 16 1.905,-11; 17 3.175,-11; 18 4.445,-11; 19 5.715,-11; 20 6.985,-11; 21 -6.985,11; 22 -5.715,11; 23 -4.445,11; 24 -3.175,11; 25 -1.905,11; 26 -0.635,11; 27 0.635,11; 28 1.905,11; 29 3.175,11; 30 4.445,11; 31 5.715,11; 32 6.985,11

### Placement (x,y rotation side)
5VBUS  80.39,13.12 0 top
5VBUS1  82.36,3.61 0 top
ADC-O3  24.81,20.43 0.2 top
AFE-CO  78.96,57.17 0 top
AFE-NO2  93.65,20.48 0 top
AFE-SO2  37.01,57.2 0.2 top
AMP-CO  88.2,55.06 0 top
AMP-NO2  97.67,16.27 0 top
AMP-O3  28.69,12.84 0 top
AMP-SO2  50.86,55.06 0 top
BATT  88.39,10.21 90 top
C1  72.67,4.46 180 top
C2  75.78,10.22 180 top
C3  77.72,7.51 90 top
C4  74.45,11.98 0 top
C5  76.94,11.96 180 top
C6  64.51,18.73 180 top
C7  70.56,18.61 0 top
C8  78.39,46.75 270 top
C9  77.02,46.78 270 top
C10  77.93,54.27 359.6 top
C11  70.4,14.39 180 top
C20  23.61,17.6 0.2 top
C30  35.78,54.28 0.2 top
C40  92.45,17.59 0 top
CHG  68.35,8.08 180 top
GND  76.78,31.16 0 bottom
IC1  70.25,12.06 90 top
J2  52.55,70.3 270 top
JP1  59,3.07 0 top
JTAG  59,67.99 180 top
L1  78.17,13.94 270 top
P1  39.77,8.53 0 top
PM5V  76.78,26.29 0 bottom
PMSCL  76.78,23.86 0 bottom
PMSDA  76.78,21.43 0 bottom
Q1  59,61.3 180 top
R1  69.86,8.09 90 top
R2  64.49,16.79 180 top
R3  68.87,5.53 180 top
R4  75.76,5.99 0 top
R5  76.25,17.39 0 top
R6  82.22,7.41 90 top
R7  70.5,16.93 0 top
R8  64.51,13.66 0 top
R9  72.48,47.61 90 top
R10  68.91,59.85 359.6 top
R11  82.83,55.29 269.6 top
R12  75.47,47.61 90 top
R13  39.35,27.22 270 top
R14  40.88,27.22 270 top
R16  73.16,28.03 90 top
R20  14.74,23.07 0.2 top
R21  31.42,19.27 270.2 top
R30  26.94,60.62 0.2 top
R31  43.95,55.91 270.2 top
R40  87.8,22.75 0 top
R41  101.06,19.27 270 top
SEL  76.78,28.72 0 bottom
SENS-CO  78.7,70.8 359.6 bottom
SENS-NO2  93.45,33.97 0 bottom
SENS-O3  24.76,33.96 0.2 bottom
SENS-SO2  36.96,71.68 0.2 bottom
U1  76.43,32.84 0 top
U2  75.75,8.06 0 top
U3  72.19,7.32 0 top
U4  75.69,14.69 270 top
U5  80.03,7.42 0 top
U6  73.95,43.88 0 top
U7  72.63,25.85 0 top
U$14  72.61,33.99 0 top
U$35  59,37.68 90 top

### Tracks (layer width: path | path; a pad name or v marks a point on that pad's centre or on a via)
3V3ACC  (via drill 0.3)
  Top 0.152: U7.2 71.47,26.02 71.47,29.45 74.42,29.45
  Top 0.254: U5.1 79.08,5.03 82.32,5.03 82.32,5.02 | 5VBUS1.TP 82.32,3.61 82.32,5.02 | 82.32,5.02 v82.92,5.02 82.86,5.08 82.86,22.12 74.42,22.12 74.42,29.45 74.42,33.47 | IC1.1 v72.12,11.11 | U$14.5 72.61,36.28 74.42,36.28 74.42,33.47 | U1.2 74.42,33.47
  Bottom 0.254: v82.92,5.02 82.92,3.6 73.48,3.6 73.48,11.11 v72.12,11.11
3V3EN
  Top 0.254: U5.6 79.08,7.91 81.61,7.91 81.61,7.96 R6.2 81.65,8.53 81.65,21.35 62.15,21.35 62.17,21.37 U$35.7
5VBOOSTEN  (via drill 0.3)
  Top 0.254: U4.1 76.8,15.99 R5.2 | 76.83,17.39 R5.2 | R5.2 77.48,17.39 v77.48,17.37 | v77.52,19.29 77.5,19.29 77.5,20.8 55.8,20.8 55.83,20.82 U$35.2
  Bottom 0.254: v77.52,19.29 77.52,17.37 v77.48,17.37
5VBUS  (via drill 0.3)
  Top 0.152: U7.7 73.78,26.02 v73.78,26.33 73.78,28.58 R16.2
  Top 0.254: C5.2 76.39,13.39 U4.5 78.17,13.39 L1.2 78.17,13.12 79.33,13.12 | 79.33,13.12 5VBUS.TP | v79.31,20.66 79.33,20.66 79.33,13.12
  Bottom 0.152: v73.78,26.33 73.78,26.29 PM5V.TP
  Bottom 0.254: v79.31,20.66 79.31,26.29 PM5V.TP
!DRDY  (via drill 0.3)
  Top 0.254: v76.06,44.85 76.06,44.64 U6.12 75.42,46.81 R12.1 | U$35.16 71.16,39.59 v71.16,38.91
  Bottom 0.254: v76.06,44.85 76.06,38.91 v71.16,38.91
!GASSENS-EN  (via drill 0.3)
  Top 0.254: ADC-O3.2 22.87,21.4 20.53,21.4 20.53,15.27 34.03,15.27 34.03,19.85 52.85,19.85 52.85,33.24 U$35.23 40.93,33.24 40.93,51.7 | AFE-SO2.2 34.22,58.19 34.22,58.42 31.71,58.42 31.71,51.7 40.93,51.7 | AFE-NO2.2 85.15,21.48 85.15,24.32 80.1,24.32 80.1,51.73 v75.29,51.73 v75.28,51.72 46.96,51.72 v46.94,51.7 | AFE-CO.2 75.31,58.17 v75.31,58.33 | 40.93,51.7 v43.11,51.7
  Bottom 0.254: v75.31,58.33 75.31,51.72 v75.28,51.72 | v46.94,51.7 v43.11,51.7
!RESET
  Top 0.254: R9.1 U6.1
CO-AMPVOUT  (via drill 0.3)
  Top 0.254: AMP-CO.4 89.57,55.08 88.2,55.08 88.2,56 AMP-CO.1 85.29,56 v85.29,54.24 | U6.4 71.77,43.12 v71.77,42.87
  Bottom 0.254: v85.29,54.24 85.29,47.92 80.42,47.92 80.42,45.61 76.84,45.61 71.03,45.61 71.03,42.87 v71.77,42.87
COVOUT
  Top 0.254: AFE-CO.8 80.89,53.56 86.83,53.56 AMP-CO.3
GND  (via drill 0.3)
  Top 0.152: C1.2 72.2,3.95 v72.17,3.95
  Top 0.203: U3.2 C1.2
  Top 0.254: v72.19,3.95 v72.17,3.95 | R1.1 69.86,6.86 v69.84,6.86 | C2.2 75.1,10.08 U2.3 75.1,8.06 U2.7 v77.01,8.06 | C3.2 v77.01,8.06 | v77.01,8.06 | R5.1 v75.69,16.78 | U4.2 v75.69,16.78 | v75.69,16.78 | C4.1 73.9,10.22 C2.2 | C2.2 76.07,11.05 77.5,11.05 77.49,11.06 C5.1 | U5.2 v80.03,6.86 | v80.03,6.86 | v80.03,6.86 80.34,6.86 80.34,6.92 82.22,6.92 R6.1 | 46.33,8.37 46.29,8.42 v46.93,8.42 | Q1.B 58.97,62.1 | 58.97,62.1 v59,62.13 | Q1.B' 58.97,62.1 | P1.C5 42.29,7.11 v41.57,7.11 | v39.65,15.21 P1.G4 v35.7,15.21 v35.7,15.2 35.7,12.26 P1.G3 | v39.65,15.21 v39.65,15.2 | P1.G5 v39.65,15.21 | AFE-CO.7 77.6,55.68 78.75,55.65 | 78.75,55.65 C10.2 | C11.2 69.25,14.39 IC1.3 69.25,11.42 v69.23,11.42 | C7.2 v72.57,18.61 | ADC-O3.7 24.42,18.93 | 24.42,18.93 24.82,18.93 ADC-O3.15 | C20.2 24.43,17.6 24.42,18.93 | ADC-O3.1 24.83,21.93 24.83,20.43 ADC-O3.15 | AFE-SO2.7 36.58,55.7 | 36.58,55.7 37.01,55.7 AFE-SO2.15 | AFE-SO2.1 37,58.7 AFE-SO2.15 | C30.2 36.58,55.7 | AFE-NO2.7 93.25,18.98 | 93.25,18.98 93.65,18.98 AFE-NO2.15 | AFE-NO2.1 93.65,21.98 AFE-NO2.15 | C40.2 93.25,18.98 | AFE-CO.1 78.96,58.68 AFE-CO.15 | U$14.2 v72.61,32.33 | AFE-CO.15 79.51,56.61 v79.51,56.33 | AFE-CO.15 78.96,55.86 78.75,55.65 | ADC-O3.15 24.81,20.83 v24.28,21.36 | AFE-SO2.15 37.01,56.92 v37.61,56.32 | AFE-NO2.15 92.48,21.65 92.48,21.93 v93.18,21.23 | U1.3 76.98,32.34 v75.5,32.34 | C6.1 v65.37,17.81 65.37,16.79 R2.1 | AMP-SO2.2 49.42,54.99 v48.82,54.99 | v85.93,55.06 AMP-CO.2 | J2.5 v51.18,66.49 v51.18,66.48 | JTAG.9 v57.08,69.84 JTAG.7 JTAG.5 JTAG.3 | BATT.1 v89.52,9.21 | v54.56,25.92 U$35.1 | AMP-NO2.2 95.22,16.27 v95.2,16.25 | v26.29,12.81 26.29,12.84 AMP-O3.2 | U6.2 71.79,44.13 v71.79,43.89 71.79,43.63 U6.3
  Top 0.254: 73.95,44.21 U6.17 | v74.31,43.48 73.95,43.48 U6.17 | U6.17 73.95,44.32 v73.5,44.32 | C8.1 78.39,47.58 C9.1 v77.03,48.2 | v72.33,26.97 72.29,26.93 U7.1
  Top 0.305: P1.G8 P1.G7 46.33,8.37 46.33,10.99 v46.34,10.99 P1.G6 v46.33,15.21 | P1.C5 | v46.33,15.21 | v46.33,15.21 P1.G5 41.96,15.19 | v43.32,2.11 P1.G9 P1.G10 35.18,2.11 P1.G1 | v35.76,8.12 35.75,8.11 P1.G2 | JP1.5 60.3,5.85 v59.49,5.03
  Bottom 1.016: v59.49,5.03 58.51,5.03
  other vias: 78.27,58 25.37,19.66 36.4,57.99 94.29,19.78
  pour Bottom: 118.24,93.06 118.24,-1.28 -7.26,-1.28 -7.26,3.48 -7.25,3.48 -7.25,92.85
N$1
  Top 0.152: U7.8 72.96,27.48 R16.1
N$2
  Top 0.254: U4.3 74.76,15.99 74.76,14.72 78.17,14.72 L1.1
N$3
  Top 0.152: U3.1 71.24,7.35 | 69.47,5.6 R3.1
  Top 0.254: R3.1 69.45,5.53 69.45,6.12 71.24,6.12 U3.1
N$4
  Top 0.152: R3.2
  Top 0.254: CHG.C R3.2
N$8
  Top 0.254: AFE-CO.9 81.51,56.14 82.78,54.5 R11.2
N$9
  Top 0.254: AFE-CO.10 81.89,56.64 R11.1
N$10
  Top 0.254: R1.2 71.24,8.61 U3.5
N$11
  Top 0.254: R10.2 80.9,59.85 AFE-CO.14
N$12
  Top 0.254: C7.1 69.46,16.93 R7.1
N$13
  Top 0.254: ADC-O3.9 28.42,19.45 28.57,19.3 30.58,19.31 R21.2
N$14
  Top 0.254: ADC-O3.10 28.57,19.95 28.76,19.76 31.12,19.77 R21.1
N$15
  Top 0.254: ADC-O3.14 26.74,22.51 26.74,23.08 R20.2
N$16
  Top 0.254: AFE-SO2.9 41.12,56.21 41.3,56.05 43.01,56.05 R31.2
N$17
  Top 0.254: R31.1 43.93,56.72 43.28,56.72 43.07,56.51 41.48,56.51 41.27,56.71 AFE-SO2.10
N$18
  Top 0.254: AFE-SO2.14 38.93,60.63 R30.2
N$19
  Top 0.254: AFE-NO2.9 97.91,19.48 98.06,19.34 100.19,19.34 R41.2
N$20
  Top 0.254: AFE-NO2.10 98.06,19.98 98.25,19.79 100.03,19.79 100.32,20.09 101.04,20.09 R41.1
N$21
  Top 0.254: AFE-NO2.14 | AFE-NO2.14 95.58,22.75 R40.2
NO2-AMPVOUT  (via drill 0.3)
  Top 0.254: AMP-NO2.4 99.02,15.33 99.02,16.24 97.67,16.24 97.67,17.21 AMP-NO2.1 95.3,17.21 v95.3,17.23 | U6.9 78.7,43.12 78.7,22.93 83.63,22.93 v83.63,19.1
  Bottom 0.254: v95.3,17.23 95.3,19.04 83.63,19.04 v83.63,19.1
NO2VOUT
  Top 0.254: AFE-NO2.8 95.58,18.43 94.3,18.43 94.3,15.33 AMP-NO2.3
O3-AMPVOUT  (via drill 0.3)
  Top 0.254: AMP-O3.4 30.06,12.82 28.64,12.82 28.64,13.78 AMP-O3.1 27.31,14.82 34.53,14.82 34.53,18.4 35.57,18.4 35.57,18.84 54.06,18.84 54.06,19.52 v59.12,19.52 | U6.8 v74.71,41.52 | v67.63,33.82 v67.63,30.01
  Bottom 0.254: v59.12,19.52 67.62,19.52 67.62,29.43 67.63,29.43 v67.63,30.01 | v74.71,41.52 74.71,40.22 67.62,40.22 67.62,34.48 67.63,34.48 v67.63,33.82
O3VOUT  (via drill 0.3)
  Top 0.254: ADC-O3.8 v26.75,18.37 | AMP-O3.3 27.31,11.87 v26.27,11.87
  Bottom 0.254: v26.75,18.37 25.56,18.37 25.56,12.08 25.56,11.87 v26.27,11.87
R-EN
  Top 0.254: U2.4 75.1,6.1 R4.1
RESET  (via drill 0.3)
  Top 0.254: v58.98,60.5 Q1.A 55.51,60.5 55.51,66.13 JTAG.10 | v58.98,60.5 | Q1.A' v58.98,60.5 | 58.95,40.86 U$35.29 | v58.95,50.93 58.95,40.86 | 58.95,40.86 58.98,40.86
  Bottom 0.254: v58.98,60.5 58.98,50.93 v58.95,50.93
SCL  (via drill 0.3)
  Top 0.152: U$14.6 70.83,35.04 70.83,25.64 71.85,25.64 71.85,25.65 72.29,25.65 U7.3
  Top 0.254: ADC-O3.3 22.87,20.9 20.99,20.9 20.99,15.73 33.57,15.73 33.57,20.31 52.21,20.31 52.21,31.97 | 73.43,57.68 AFE-CO.3 | v33.49,57.69 AFE-SO2.3 | AFE-NO2.3 84.64,20.98 84.64,23.87 79.65,23.87 79.65,51.06 74.22,51.06 | 74.22,51.06 74.19,51.06 U6.14 | v73.46,51.06 74.22,51.06 | v73.43,58.2 73.43,57.68 | 30.84,48.16 40.31,48.16 40.31,31.95 40.94,31.95 | v30.84,49.17 30.84,48.16 | 30.84,48.16 30.82,48.16 | U$14.6 71.96,36.88 | U1.1 76.96,34.74 76.96,36.92 71.96,36.92 71.96,36.88 | 40.94,31.95 48,31.95 U$35.22 52.21,31.97 | v46.1,57.15 46.1,57.68 73.43,57.68 | R14.1 40.88,28.69 v40.91,28.69 | v40.94,31.61 40.94,31.95 | 52.21,31.97 v52.21,32.38 v52.2,32.38 | v71.55,36.88 71.96,36.88
  Bottom 0.254: v46.1,57.15 46.1,55.51 33.49,55.51 v33.49,57.69 33.34,57.69 33.34,57.8 30.87,57.8 30.87,49.17 v30.84,49.17 | v73.46,51.06 73.46,57.68 73.45,57.68 73.45,58.17 v73.43,58.2 | v40.94,31.61 40.94,28.69 v40.91,28.69 | v71.55,36.88 v71.55,36.9 69.12,36.9 69.12,32.38 v52.2,32.38
SCL5V  (via drill 0.3)
  Top 0.152: v73.75,25.32 73.7,25.32 73.7,25.65 72.96,25.65 U7.6
  Bottom 0.152: v73.75,25.32 75.22,25.32 75.22,23.84 76.78,23.84 PMSCL.TP
SDA  (via drill 0.3)
  Top 0.152: U7.4 72.29,24.99 v71.85,24.99
  Top 0.254: ADC-O3.4 21.45,20.43 21.45,16.19 33.11,16.19 33.11,20.77 51.56,20.77 51.56,30.7 | AFE-SO2.4 33.96,57.19 33.77,57 32.56,57 v32.55,57.01 | v47,56.75 v46.99,56.75 46.99,57.18 72.75,57.18 | 72.75,57.18 AFE-CO.4 | AFE-NO2.4 84.16,20.48 84.16,23.44 79.19,23.44 79.19,50.08 v75.73,50.08 74.71,49.07 U6.13 | v72.75,56.62 72.75,57.18 | v38.98,47.04 39.62,47.04 39.62,30.7 | v71.58,32.28 71.96,32.28 U$14.1 | v75.17,31.14 75.17,30.93 U1.4 | 39.62,30.7 U$35.21 | U$35.21 | 51.56,30.7 U$35.21 | R13.1 39.35,30.7 39.62,30.7 | 51.56,30.7 v51.56,31.11
  Bottom 0.152: v71.85,24.99 70.52,24.99 70.52,31.11
  Bottom 0.254: v47,56.75 47,55.01 32.55,55.01 v32.55,57.01 32.55,47.04 v38.98,47.04 | v75.73,50.08 72.74,50.08 v72.74,56.62 v72.75,56.62 | v71.58,32.28 71.48,32.28 71.48,31.11 71.66,31.11 | v75.17,31.14 75.15,31.11 71.66,31.11 | v51.56,31.11 70.52,31.11 71.66,31.11
SDA5V  (via drill 0.3)
  Top 0.152: U7.5 73.02,25.32 v73.02,24.73
  Bottom 0.152: v73.02,24.73 73.02,21.76 76.45,21.76 PMSDA.TP
SIM1V8  (via drill 0.3)
  Top 0.254: v43.04,3.96 P1.C1 | v69.12,40.86 U$35.17
  Bottom 0.254: v69.12,40.86 66.96,40.86 66.96,47.23 44.1,47.23 44.1,3.96 v43.04,3.96
SIMCLK  (via drill 0.3)
  Top 0.152: 37.31,3.96 P1.C3
  Top 0.254: v37.35,4.67 37.33,4.67 P1.C3 | v68.46,43.4 U$35.19
  Bottom 0.254: v68.46,43.4 68.46,48.53 42.51,48.53 42.51,5.97 37.35,5.97 v37.35,4.67
SIMIO  (via drill 0.3)
  Top 0.152: 37.24,7.13 P1.C7
  Top 0.254: v37.24,7.84 37.24,7.13 | U$35.18 v69.09,42.13
  Bottom 0.254: v69.09,42.13 69.09,49.13 41.69,49.13 41.69,7.84 v37.24,7.84
SIMRESET  (via drill 0.3)
  Top 0.254: P1.C2 v39.77,4.64 | U$35.20 v67.8,44.67
  Bottom 0.254: v39.77,4.64 39.82,4.69 43.31,4.69 43.31,47.91 67.8,47.91 v67.8,44.67
SO2-AMPVOUT  (via drill 0.3)
  Top 0.254: AMP-SO2.4 52.23,54.88 50.91,54.88 50.91,56 AMP-SO2.1 v48.08,56 | v72.83,42.01 72.83,42.41 U6.5
  Bottom 0.254: v48.08,56 v48.09,56 48.09,49.75 70.39,49.75 70.39,42.01 v72.83,42.01
SO2VOUT
  Top 0.254: AFE-SO2.8 40.8,55.71 40.8,54.14 49.49,54.14 AMP-SO2.3
SPEC-CO-COUNTER  (via drill 0.35)
  Top 0.254: v67.14,78.71 67.14,59.86 R10.1
  Bottom 0.254: SENS-CO.6 67.14,78.73 v67.14,78.71
SPEC-CO-REF  (via drill 0.3)
  Top 0.254: AFE-CO.13 85.23,58.17 85.23,60.34 85.94,60.34 86.19,60.34 90.18,60.34 v90.18,78.86
  Bottom 0.254: SENS-CO.5 90.18,78.87 v90.18,78.86
SPEC-CO-WKG  (via drill 0.3)
  Top 0.254: AFE-CO.12 87.12,57.66 v87.12,57.65
  Bottom 0.254: v87.12,57.65 87.14,57.65 87.14,61.51 | SENS-CO.10 68.76,61.51 87.08,61.51 87.14,61.51 | SENS-CO.1 88.76,61.51 87.14,61.51
SPEC-NO2-COUNTER  (via drill 0.3)
  Top 0.254: v81.94,41.97 81.94,24.8 87,24.8 R40.1
  Bottom 0.254: SENS-NO2.6 v81.94,41.97
SPEC-NO2-REF  (via drill 0.3)
  Top 0.254: AFE-NO2.13 97.44,21.48 97.44,23.79 104.2,23.79 104.2,24.8 105.04,24.8 105.04,41.97 v105.06,41.97
  Bottom 0.254: SENS-NO2.5 v105.06,41.97
SPEC-NO2-WKG  (via drill 0.3)
  Top 0.254: AFE-NO2.12 v98.68,20.98
  Bottom 0.254: SENS-NO2.10 83.45,24.55 98.66,24.55 98.68,24.55 | 98.68,24.55 103.45,24.55 | 103.47,24.55 103.45,24.55 | 103.45,24.55 SENS-NO2.1 | v98.68,20.98 98.68,24.55
SPEC-O3-COUNTER  (via drill 0.35)
  Top 0.254: v13.16,42.02 13.16,23.07 R20.1
  Bottom 0.254: v13.16,42.02 14.79,42.02 SENS-O3.6
SPEC-O3-REF  (via drill 0.3)
  Top 0.254: ADC-O3.13 28.18,21.44 28.18,23.66 36.4,23.66 v36.4,41.91
  Bottom 0.254: SENS-O3.5 v36.4,41.92 v36.4,41.91
SPEC-O3-WKG  (via drill 0.3)
  Top 0.254: ADC-O3.12 29.18,20.95 v29.2,20.93
  Bottom 0.254: SENS-O3.10 14.73,24.47 29.17,24.47 29.2,24.47 | 29.2,24.47 34.73,24.47 SENS-O3.1 | v29.2,20.93 29.2,24.47
SPEC-SO2-COUNTER  (via drill 0.35)
  Top 0.254: v25.54,79.71 24.8,79.71 24.8,60.57 26.14,60.57 R30.1
  Bottom 0.254: SENS-SO2.6 v25.55,79.71 v25.54,79.71
SPEC-SO2-REF  (via drill 0.3)
  Top 0.254: AFE-SO2.13 40.85,58.21 41.13,58.21 41.13,61.43 48.57,61.43 v48.57,79.65
  Bottom 0.254: SENS-SO2.5 v48.57,79.65
SPEC-SO2-WKG  (via drill 0.3)
  Top 0.254: AFE-SO2.12 v41.87,57.72 v41.87,57.73
  Bottom 0.254: 41.86,62.39 v41.88,57.73 v41.87,57.73 | SENS-SO2.1 46.93,62.39 41.86,62.39 | SENS-SO2.10 26.93,62.39 41.86,62.39
SWCLK  (via drill 0.3)
  Top 0.254: J2.4 54.92,67.76 v54.92,67.78 60.27,67.78 JTAG.4 | U$35.30 54.89,42.13 v54.89,50.86
  Bottom 0.254: v54.89,50.86 54.89,67.78 v54.92,67.78
SWDIO  (via drill 0.3)
  Top 0.254: 55.41,69.02 55.41,68.19 61.54,68.19 JTAG.2 | J2.2 53.18,69.02 v54.1,69.02 55.41,69.02 | 55.41,69.02 55.41,69.03 | U$35.31 53.98,43.4 v53.98,50.86
  Bottom 0.254: v53.98,50.86 54.39,51.28 54.39,66.91 54.26,67.05 54.26,68.87 v54.1,69.02
VBAT  (via drill 0.3)
  Top 0.203: U3.3 C1.1
  Top 0.254: U3.3 73.16,6 | 73.14,4.44 C1.1 | R4.2 76.4,6.07 U2.6 | R4.2 77.72,5.99 C3.1 | 76.31,5.08 | 76.31,5.08 R4.2 | C1.1 75.66,4.45 v75.66,5.05 76.31,5.05 76.31,5.08 | U4.4 75,13.39 C4.2 v75,11.38 v75.01,11.38 | v66.3,13.65 R8.2 | BATT.2 v89.62,11.21
  Bottom 0.254: v66.3,13.65 75.01,13.65 v75.01,11.38 75.66,11.38 v75.66,5.05 75.99,4.72 82.18,4.72 82.18,5.76 82.2,5.76 82.2,11.21 v89.62,11.21
VBUS
  Top 0.254: 73.17,8.65 U3.4 73.14,10 68.35,10 | 68.35,10 CHG.A | JP1.1 57.7,10 68.35,10
VDD  (via drill 0.3)
  Top 0.152: R12.2 76.21,48.41 76.21,45.98 C9.2
  Top 0.254: U2.1 76.4,10.15 C2.1 80.02,10.22 | U5.4 U5.5 80.03,10.22 80.02,10.22 | v80.02,11.16 80.02,10.22 | AFE-CO.6 76.03,56.2 76.03,54.28 C10.1 77.13,53.26 | ADC-O3.6 21.92,19.42 21.93,17.59 | 21.93,17.59 C20.1 | AFE-SO2.6 34.09,56.19 34.09,54.25 34.98,54.26 C30.1 34.98,53.26 44.97,53.26 | AFE-NO2.6 90.5,19.48 90.5,17.59 | 90.5,17.59 C40.1 | 21.93,17.59 21.93,16.7 27.09,16.7 27.1,16.69 30.87,16.69 | 30.87,16.69 32.6,16.69 32.6,21.27 40.88,21.27 | v50.79,24.29 50.79,21.27 40.88,21.27 | 53.48,53.26 44.97,53.26 | 77.13,53.26 53.48,53.26 | 90.5,17.59 90.5,16.13 v90.63,16 | 44.97,53.26 v44.97,46.39 v44.98,46.39 | C40.1 91.7,17.59 | 53.48,53.26 53.48,56 AMP-SO2.5 52.25,56 v52.25,56.48 | 77.13,53.26 77.76,53.26 | 77.76,53.26 80.35,53.26 80.35,52.74 90.77,52.74 90.77,56 AMP-CO.5 | U$35.3 v57.09,24.34 | U$35.8 63.47,25.18 v63.47,24.34 | JTAG.1 61.54,71.46 51.16,71.46 v51.16,69.05 v51.16,69.03 J2.1 | C40.1 91.65,15.1 93.66,15.1 93.66,13.98 101,13.98 101,17.18 99.05,17.18 AMP-NO2.5 | AMP-O3.5 v30.86,13.78 | v30.89,17.1 30.87,17.1 30.87,16.69 | v77.74,52.62 77.76,52.62 77.76,53.26 | U6.10 78.39,43.63 C8.2 77.71,45.95 77.71,45.98 | U6.11 77.02,44.13 C9.2 77.71,45.98 | 77.71,45.98 v77.71,46.38 | R9.2 72.33,48.41 v72.33,49.04 | R12.2 75.47,48.99 v75.81,48.99 | 40.88,21.27 R14.2 R13.2
  Bottom 0.152: v50.79,24.29
  Bottom 0.254: v80.02,11.16 80.02,14.44 | 80.02,14.44 80.02,16 v90.63,16 | v44.98,46.39 44.98,24.29 v50.79,24.29 57.09,24.29 v57.09,24.34 | v57.09,24.34 v63.47,24.34 | v51.16,69.05 50.45,69.05 50.45,65.75 50.45,56.45 52.25,56.45 v52.25,56.48 | v30.89,17.1 30.89,13.8 v30.86,13.78 | v57.09,24.34 57.09,14.44 80.02,14.44 | v77.74,52.62 77.74,46.38 v77.71,46.38 | v72.33,49.04 72.33,48.99 v75.81,48.99
VDIV  (via drill 0.3)
  Top 0.254: C6.2 63.66,16.79 R2.2 63.64,15.24 v63.66,15.24 | v63.66,15.24 v63.67,15.24 | R8.1 v63.66,15.24 | U$35.9 69.28,30.7 v69.28,22.33
  Bottom 0.254: v63.67,15.24 69.28,15.24 v69.28,22.33
VREFADC  (via drill 0.3)
  Top 0.254: IC1.2 71.25,14.39 | 71.25,14.39 C11.1 | 71.25,14.39 71.3,14.39 R7.2 74.32,16.93 74.32,18.45 | v30.07,20.45 29.68,20.45 29.48,20.25 28.91,20.25 28.71,20.45 ADC-O3.11 | AFE-SO2.11 41.42,57.22 41.59,57.04 42.16,57.05 42.33,57.22 42.73,57.22 42.73,58.22 72.25,58.22 v72.25,59.07 | v99.74,20.48 99.15,20.48 98.96,20.29 98.4,20.29 98.21,20.48 AFE-NO2.11 | AFE-CO.11 84.07,57.16 v84.28,56.95 | v78.42,18.41 78.42,18.45 74.32,18.45 | 74.32,18.45 74.32,20.16 53.46,20.16 53.46,19.33 34.73,19.33 v34.73,19.19
  Bottom 0.254: v30.07,20.45 34.73,20.45 v34.73,19.19 | v72.25,59.07 82.04,59.07 82.04,56.95 v84.28,56.95 91.49,56.95 91.49,51.92 85.96,51.92 85.96,47.31 81.03,47.31 81.03,18.41 | v99.74,20.48 99.74,14.75 92.47,14.75 92.47,18.41 81.03,18.41 | v78.42,18.41 81.01,18.41 81.03,18.41

### Text on the board
tPlace: ECOBit PV1
tNames: RESET